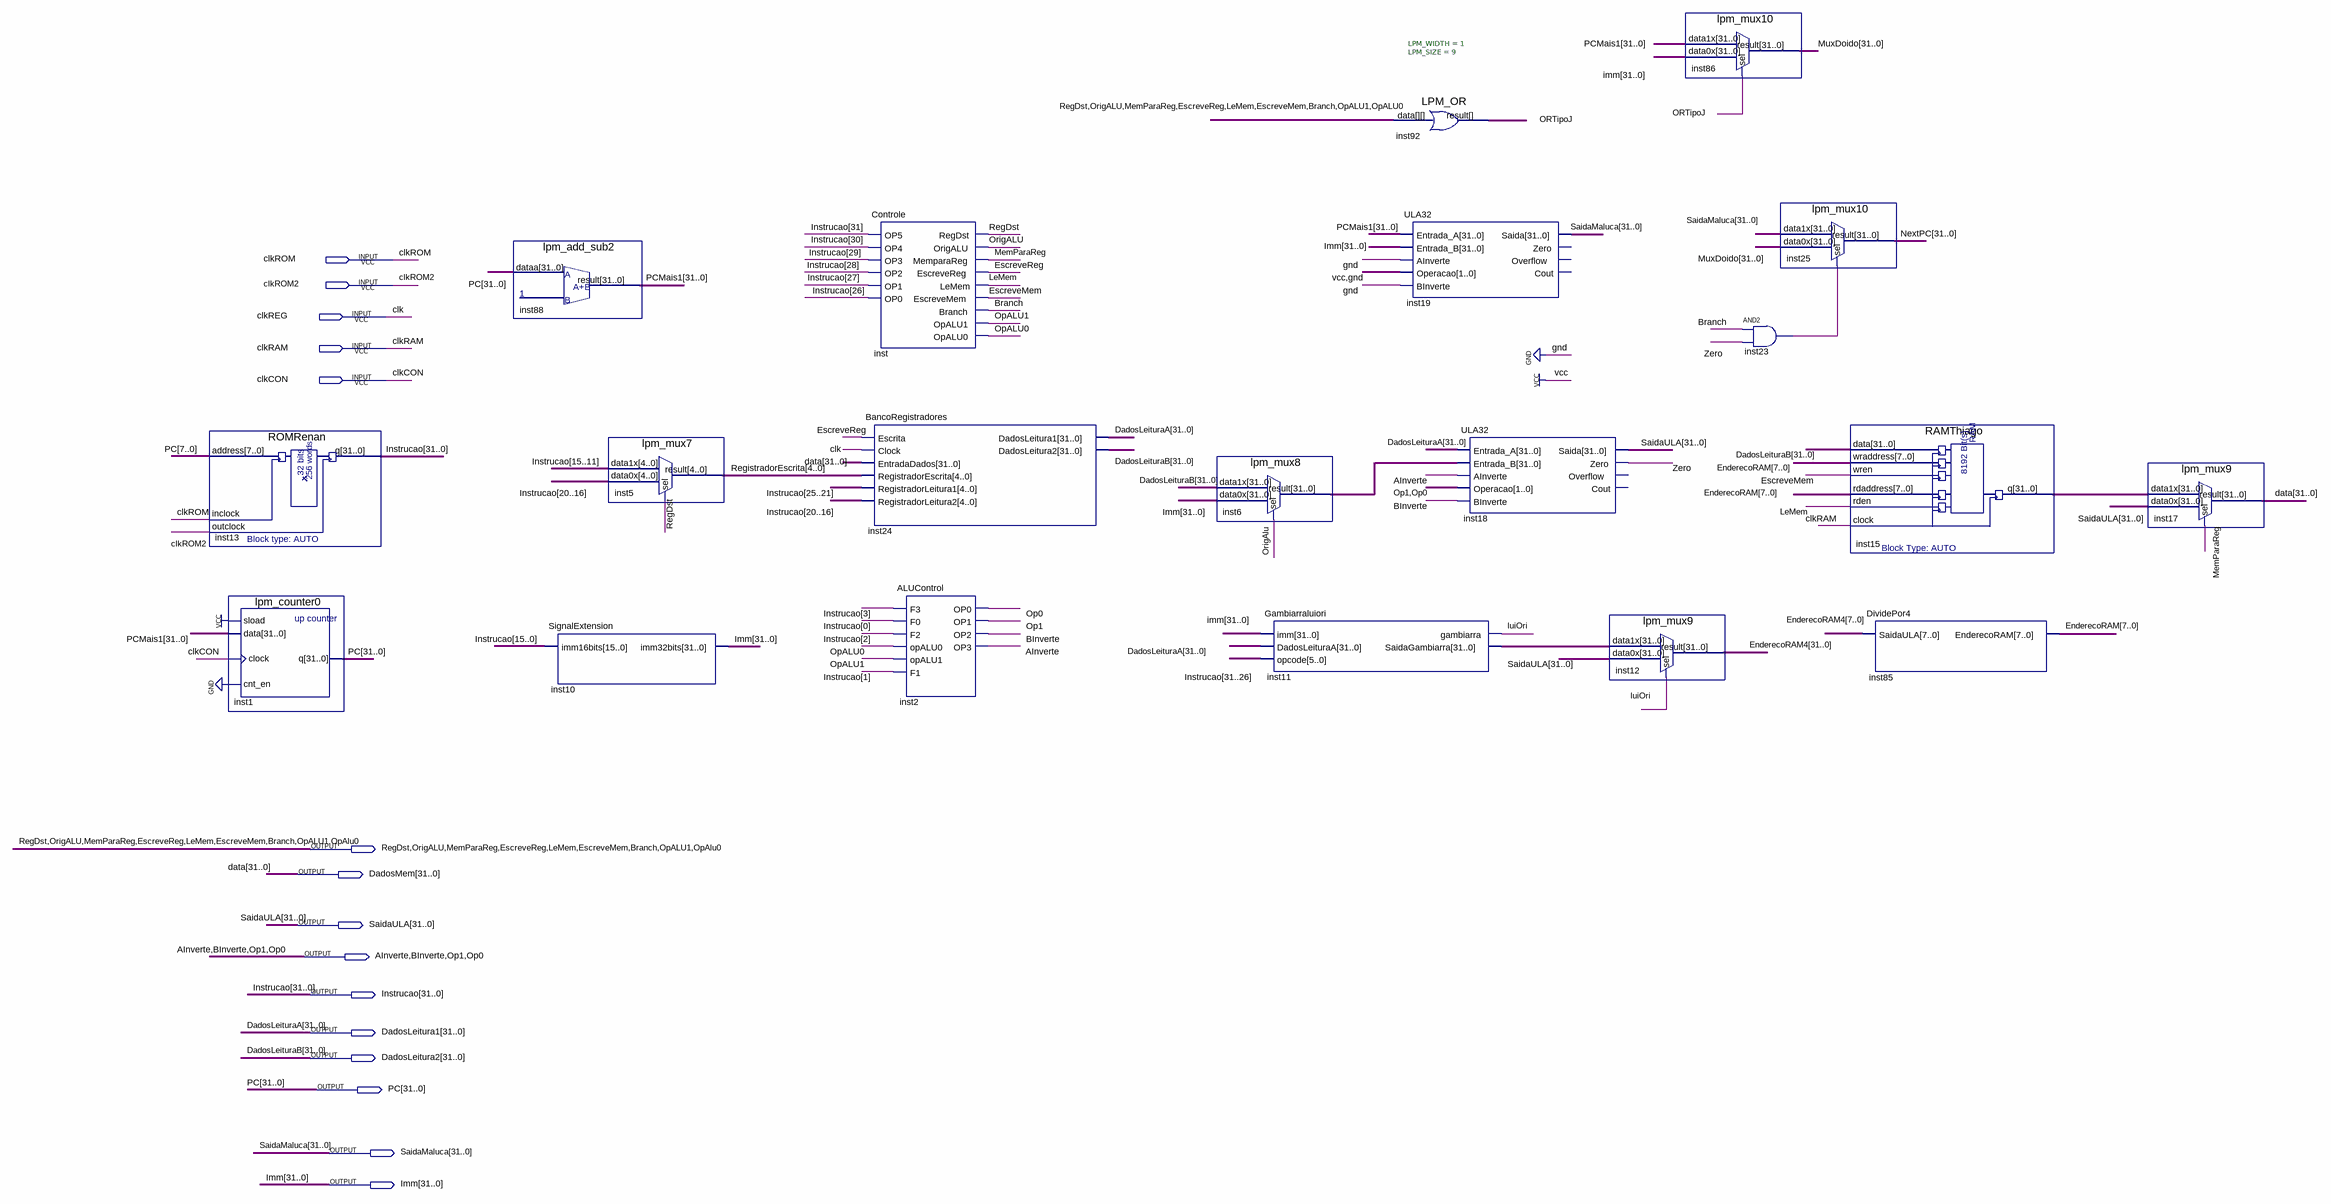
[diagram p0: schematic sheet]
// Quartus schematic MIPSUniciclo.bdf as structural Verilog: 20 symbols, 15 pins
module MIPSUniciclo (
  input  clkROM,
  input  clkROM2,
  input  clkREG,
  input  clkRAM,
  input  clkCON,
  output RegDst,
  output OrigALU,
  output MemParaReg,
  output EscreveReg,
  output LeMem,
  output EscreveMem,
  output Branch,
  output OpALU1,
  output OpAlu0,
  output [31:0] DadosMem,
  output [31:0] SaidaULA,
  output AInverte,
  output BInverte,
  output Op1,
  output Op0,
  output [31:0] Instrucao,
  output [31:0] DadosLeitura1,
  output [31:0] DadosLeitura2,
  output [31:0] PC,
  output [31:0] SaidaMaluca,
  output [31:0] Imm
);

  wire inst23_out, luiOri, ORTipoJ, Zero;
  wire [4:0] RegistradorEscrita;
  wire [7:0] EnderecoRAM;
  wire [31:0] EnderecoRAM4, inst6_result, inst11_saidagambiarra, inst15_q, MuxDoido, NextPC, PCMais1;

  ROMRenan inst13 (.address(PC[7:0]), .inclock(clkROM), .outclock(clkROM2), .q(Instrucao));
  lpm_counter0 inst1 (.sload(1'b1), .data(PCMais1), .clock(clkCON), .cnt_en(1'b0), .q(PC));
  lpm_add_sub2 inst88 (.dataa(PC), .result(PCMais1));
  SignalExtension inst10 (.imm16bits(Instrucao[15:0]), .imm32bits(Imm));
  lpm_mux7 inst5 (.data1x(Instrucao[15:11]), .data0x(Instrucao[20:16]), .sel(RegDst), .result(RegistradorEscrita));
  Controle inst (
    .OP5(Instrucao[31]), .OP4(Instrucao[30]), .OP3(Instrucao[29]), .OP2(Instrucao[28]), .OP1(Instrucao[27]),
    .OP0(Instrucao[26]), .RegDst(RegDst), .OrigALU(OrigALU), .MemparaReg(MemParaReg),
    .EscreveReg(EscreveReg), .LeMem(LeMem), .EscreveMem(EscreveMem), .Branch(Branch), .OpALU1(OpALU1),
    .OpALU0(OpAlu0));
  BancoRegistradores inst24 (
    .Escrita(EscreveReg), .Clock(clkREG), .EntradaDados(DadosMem), .RegistradorEscrita(RegistradorEscrita),
    .RegistradorLeitura1(Instrucao[25:21]), .RegistradorLeitura2(Instrucao[20:16]),
    .DadosLeitura1(DadosLeitura1), .DadosLeitura2(DadosLeitura2));
  ALUControl inst2 (
    .F3(Instrucao[3]), .F0(Instrucao[0]), .F2(Instrucao[2]), .opALU0(OpAlu0), .opALU1(OpALU1),
    .F1(Instrucao[1]), .OP0(Op0), .OP1(Op1), .OP2(BInverte), .OP3(AInverte));
  lpm_mux8 inst6 (.data1x(DadosLeitura2), .data0x(Imm), .sel(OrigALU), .result(inst6_result));
  Gambiarraluiori inst11 (
    .imm(Imm), .DadosLeituraA(DadosLeitura1), .opcode(Instrucao[31:26]), .gambiarra(luiOri),
    .SaidaGambiarra(inst11_saidagambiarra));
  LPM_OR #(.LPM_WIDTH(1), .LPM_SIZE(9)) inst92 (
    .data({RegDst, OrigALU, MemParaReg, EscreveReg, LeMem, EscreveMem, Branch, OpALU1, OpAlu0}),
    .result(ORTipoJ));
  ULA32 inst19 (
    .Entrada_A(PCMais1), .Entrada_B(Imm), .AInverte(1'b0), .Operacao(2'b10), .BInverte(1'b0),
    .Saida(SaidaMaluca));  // open: Zero, Overflow, Cout
  ULA32 inst18 (
    .Entrada_A(DadosLeitura1), .Entrada_B(inst6_result), .AInverte(AInverte), .Operacao({Op1, Op0}),
    .BInverte(BInverte), .Saida(SaidaULA), .Zero(Zero));  // open: Overflow, Cout
  lpm_mux9 inst12 (.data1x(inst11_saidagambiarra), .data0x(SaidaULA), .sel(luiOri), .result(EnderecoRAM4));
  lpm_mux10 inst86 (.data1x(PCMais1), .data0x(Imm), .sel(ORTipoJ), .result(MuxDoido));
  and inst23 (inst23_out, Branch, Zero);
  lpm_mux10 inst25 (.data1x(SaidaMaluca), .data0x(MuxDoido), .sel(inst23_out), .result(NextPC));
  RAMThiago inst15 (
    .data(DadosLeitura2), .wraddress(EnderecoRAM), .wren(EscreveMem), .rdaddress(EnderecoRAM), .rden(LeMem),
    .clock(clkRAM), .q(inst15_q));
  DividePor4 inst85 (.SaidaULA(EnderecoRAM4[7:0]), .EnderecoRAM(EnderecoRAM));
  lpm_mux9 inst17 (.data1x(inst15_q), .data0x(SaidaULA), .sel(MemParaReg), .result(DadosMem));

  // Other names for the same wires on the sheet: clk = clkREG; DadosLeituraA[31:0] = DadosLeitura1;
  //   DadosLeituraB[31:0] = DadosLeitura2; data[31:0] = DadosMem
endmodule
